# Altium schematic sheet DAC.SchDoc: Digital to analog converter.
size 297 x 209 mm; Author: Dmitry Shpakov; Organization: NoName; Revision: Revision; SheetNumber: 7; SheetTotal: 10; PageSize: A4; ProjectName: Project Name
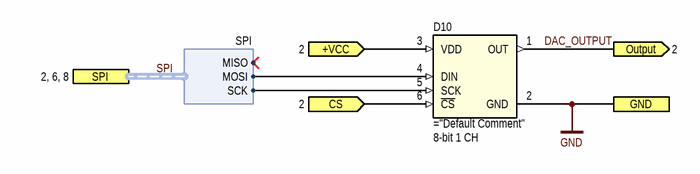
[diagram p0: DAC.SchDoc]

## Parts
D10  value 8-bit 1 CH  (no BOM)

## Ports
+VCC (in, see 2), CS (in, see 2), GND (see 2, 3, 4, 5, 6, 8, 9, 10), Output (out, see 2), SPI (harness SPI, see 2, 6, 8)

## Harnesses
SPI: MISO, MOSI, SCK

## Nets
GND: D10.2(GND) ; port GND
+VCC: D10.3(VDD) ; port +VCC
CS: D10.6(~{CS}) ; port CS
DAC_OUTPUT: D10.1(OUT) ; port Output
SPI.MOSI: D10.4(DIN) ; port SPI.MOSI
SPI.SCK: D10.5(SCK) ; port SPI.SCK

## Buses and harness runs
harness SPI = port SPI

## Notes on the sheet
- Author
- Date
- Organization
- Page
- Total pages
- Materials
- Page size

## Library data of the parts
D10 = MAX5385EZT+T: IC DAC 8BIT V-OUT TSOT23-6; Manufacturer: Analog Devices Inc./Maxim Integrated; Power Dissipation: * W; Rated Voltage: 2.7 V ~ 5.5 V; Rated Current: * A; Tolerance: * %; Other: 8 Bit Digital to Analog Converter 1 TSOT-23-6; Operating Temperature: -40 °C to +125 °C; Type: ic; HelpURL: https://www.digikey.com/en/products/detail/analog-devices-inc-maxim-integrated/MAX5385EZT-T/1781900; Default Comment: MAX5385EZT+T; Rated Power: * W; Summary: ="Type"+" "+"Part Number"+" "+"Manufacturer"+" "+"Value"+" "+"Tolerance"+" "+"Operating Temperature"+" "+"Case"+" "+"Power Dissipation"+" "+"Rated Current"+" "+"Rated Power"+" "+"Rated Voltage"+" "+"Other"; Assembly: *; Case: SOT-23-6; Part Number: MAX5385EZT+T